# EAGLE design Underwater Camera Rev. A (EAGLE 9.4.0)

## Sheet 1 of 2
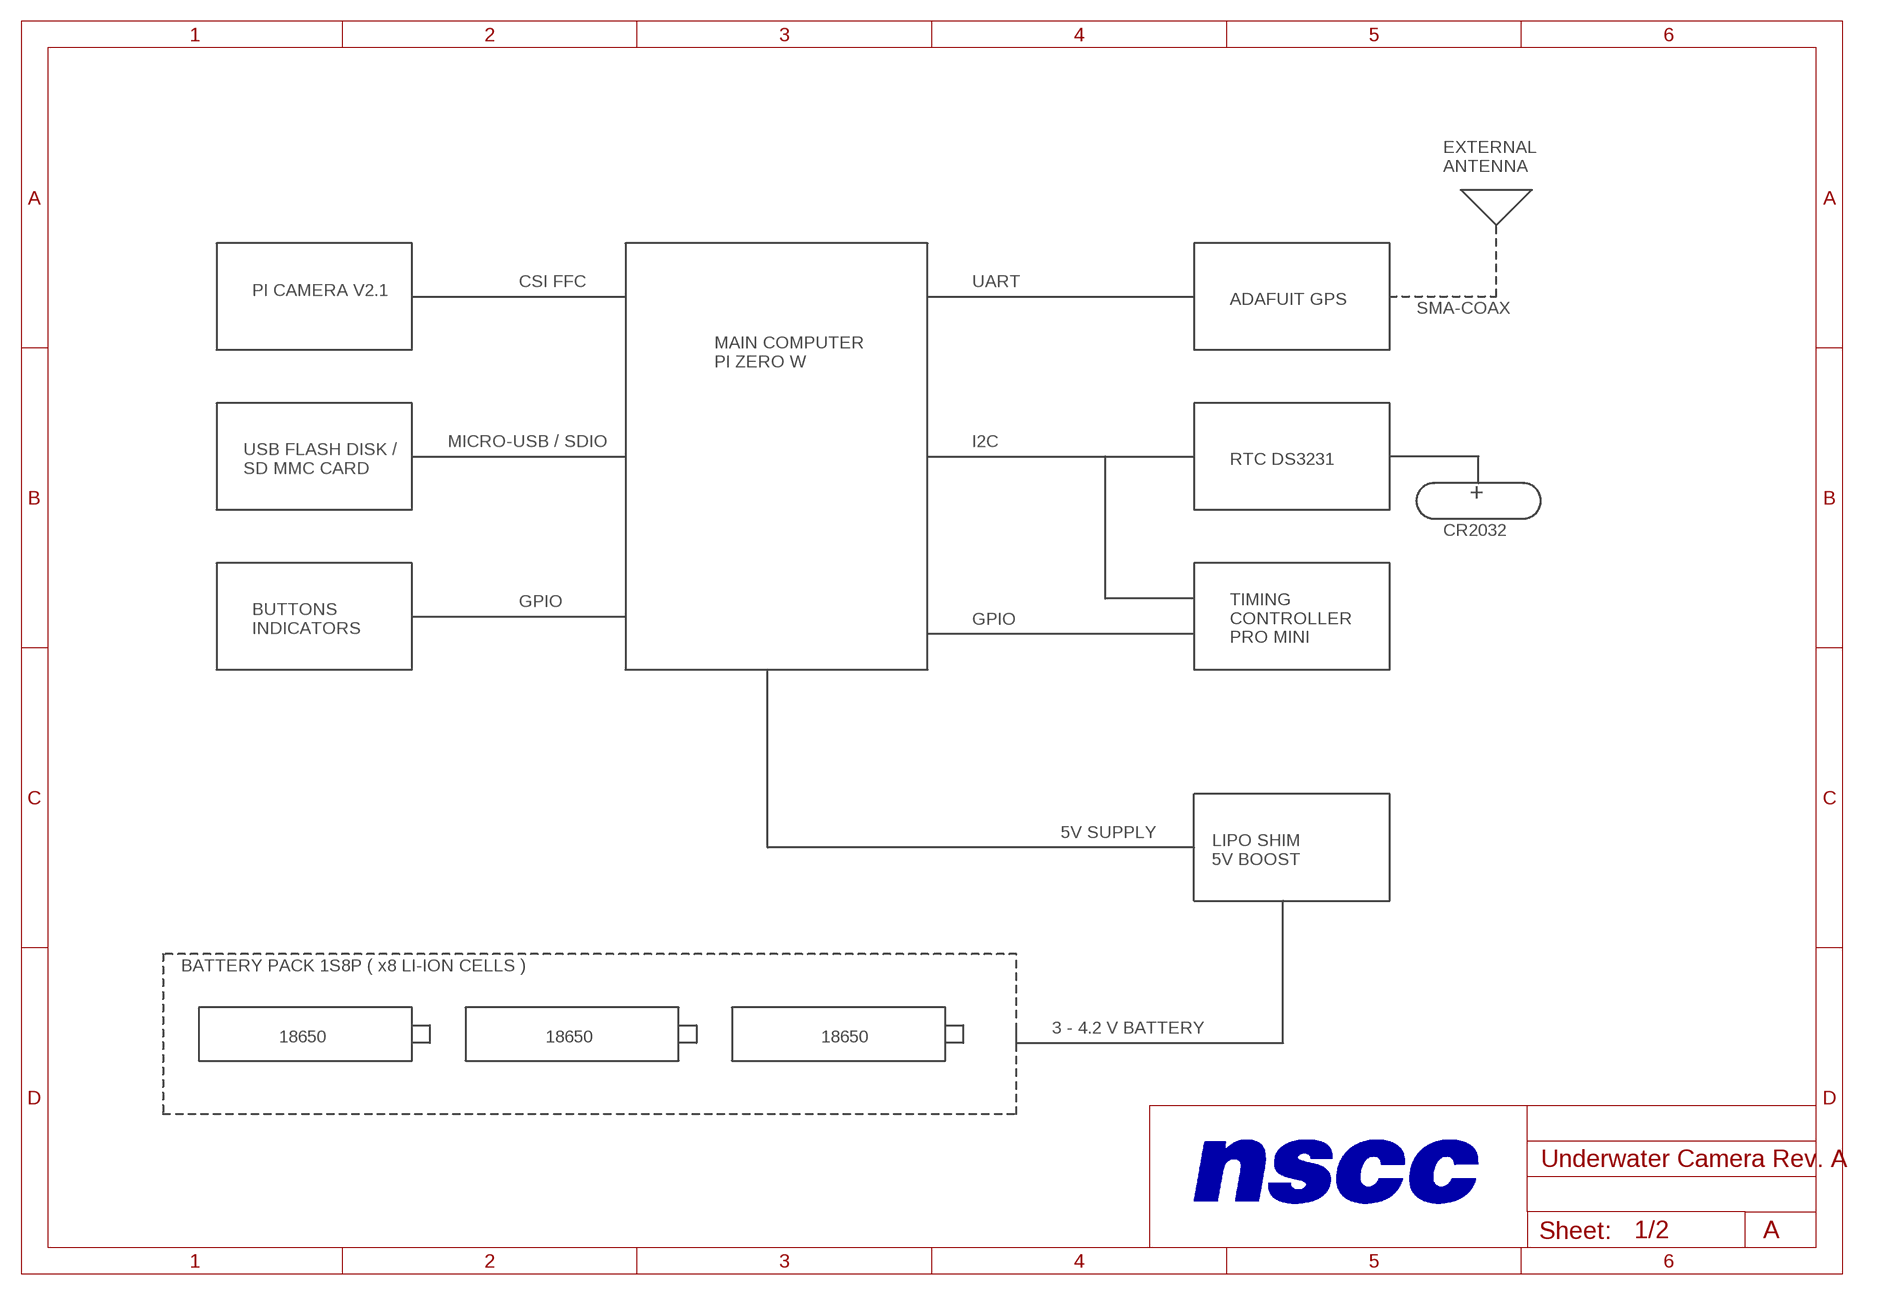
[diagram p0: schematic, sheet 1]

### Notes on the sheet
- EXTERNAL 
  ANTENNA
- CSI FFC | UART
- PI CAMERA V2.1
- ADAFUIT GPS
- SMA-COAX
- MAIN COMPUTER
  PI ZERO W
- MICRO-USB / SDIO | I2C
- RTC DS3231
- USB FLASH DISK /
  SD MMC CARD
- +
- CR2032
- GPIO
- GPIO
- BUTTONS
  INDICATORS
- TIMING 
  CONTROLLER
  PRO MINI
- 5V SUPPLY
- LIPO SHIM
  5V BOOST
- BATTERY PACK 1S8P ( x8 LI-ION CELLS )
- 3 - 4.2 V BATTERY
- 18650 | 18650 | 18650
- A

## Sheet 2 of 2
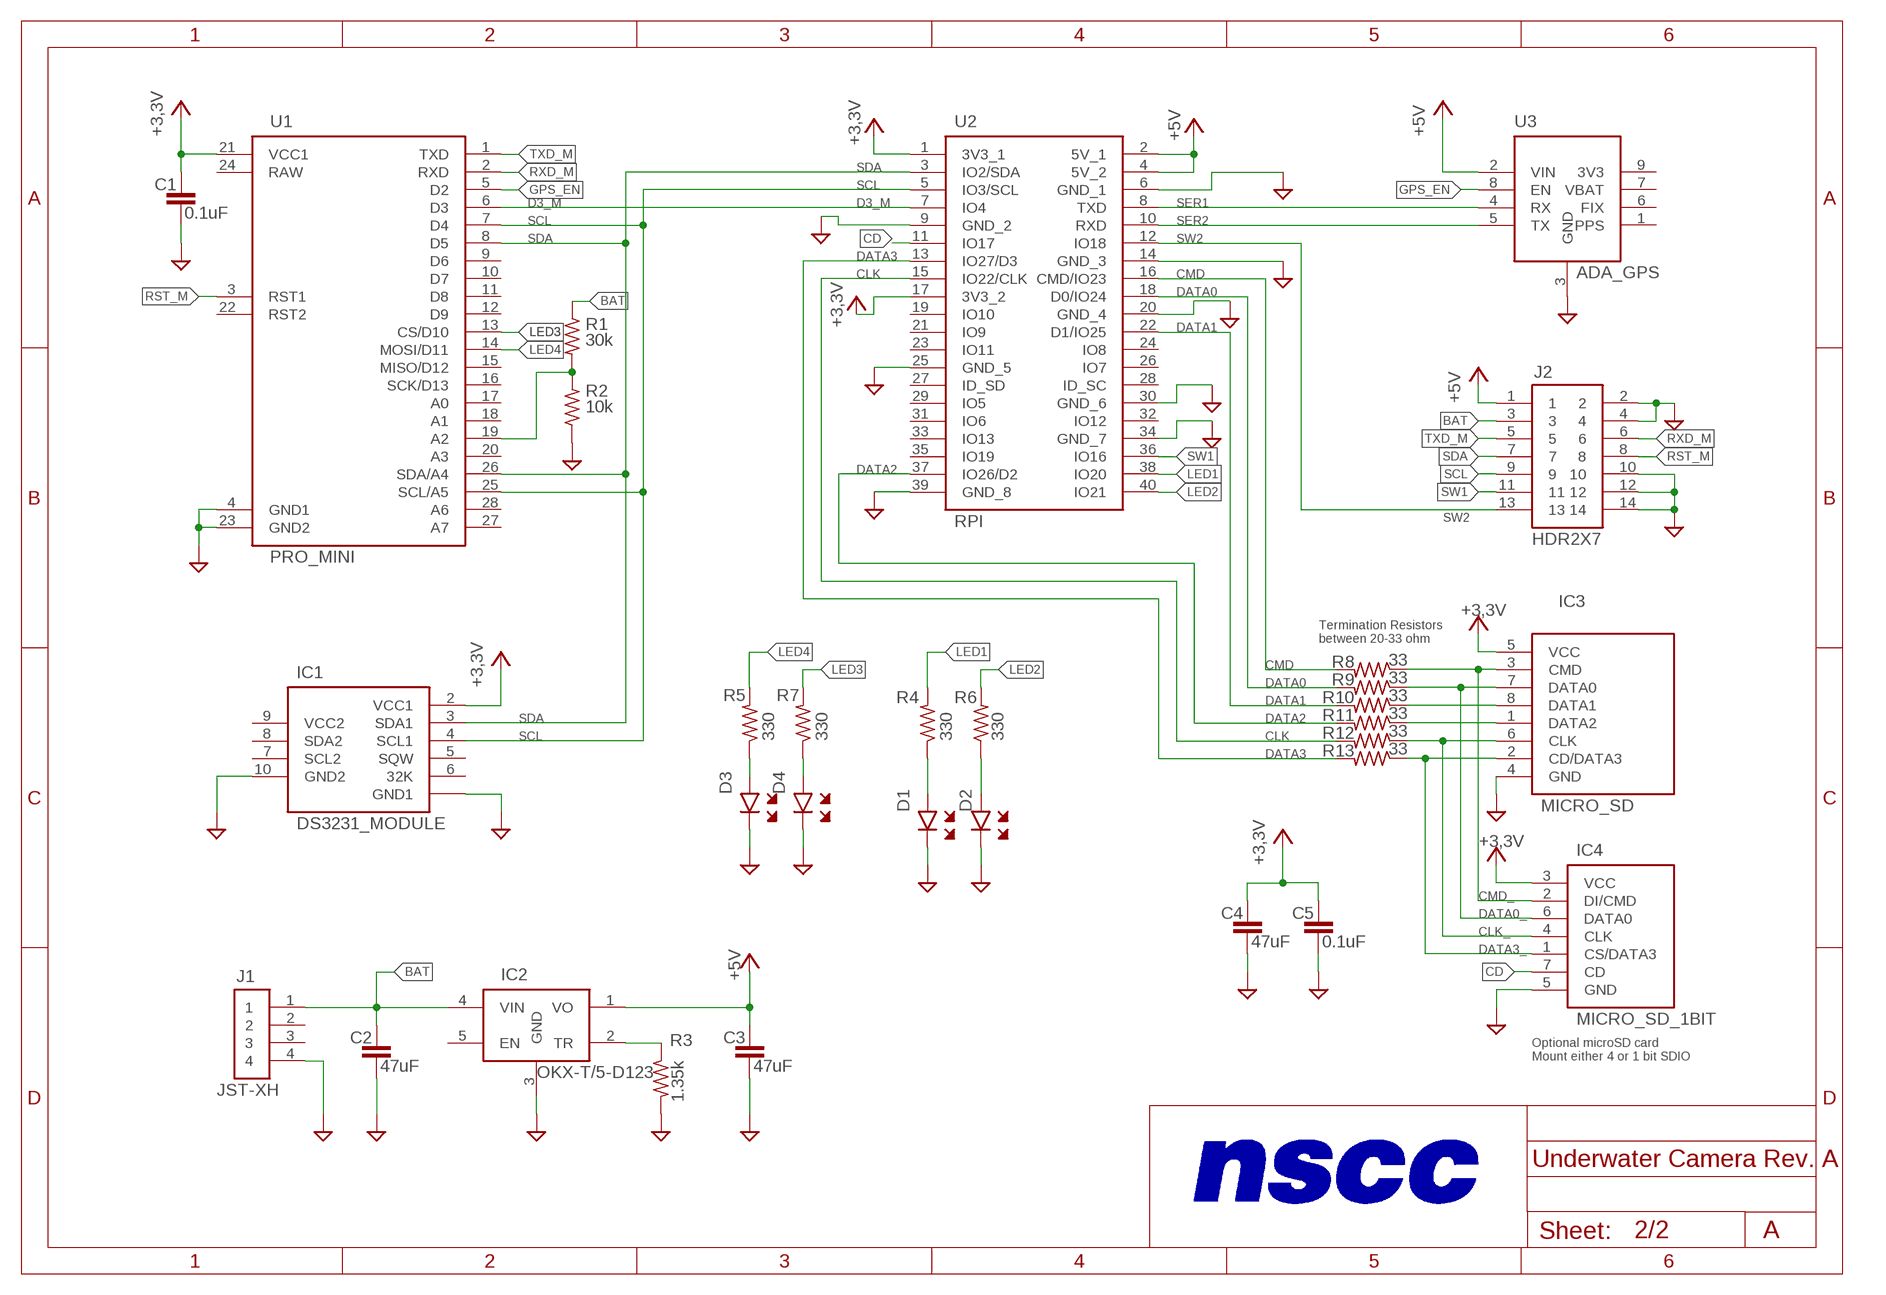
[diagram p1: schematic, sheet 2]

### Parts
C1  0.1uF  CAP_THCAP-TH-2MM  [CAPPRD254W65D300H300B]
C2  47uF  CAP_THCAP-ELECTRO-5.08  [CAPPRD508W65D1000H1100B]
C3  47uF  CAP_THCAP-ELECTRO-5.08  [CAPPRD508W65D1000H1100B]
C4  47uF  CAP_THCAP-ELECTRO-5.08  [CAPPRD508W65D1000H1100B]
C5  0.1uF  CAP_THCAP-TH-2MM  [CAPPRD254W65D300H300B]
D1  LED_THLED-2.54  [LEDRD254W60D565H860B]
D2  LED_THLED-2.54  [LEDRD254W60D565H860B]
D3  LED_THLED-2.54  [LEDRD254W60D565H860B]
D4  LED_THLED-2.54  [LEDRD254W60D565H860B]
IC1  DS3231_MODULE  [DS3231_MODULE]
IC2  OKX-T/5-D123  OKX-T/5-D123DMODEL  [OKX-T/5-D12]
IC3  MICRO_SD  MICRO_SD_SNIFFER  [MICRO_SD_SDIO]
IC4  MICRO_SD_1BIT  MICRO_SD  [MICRO_SD_SDIO1B]
J1  JST-XH  HDR1X4JST-XH  [HDR1X4]
J2  HDR2X7  HDR2X7HDR2X7  [HDR2X7]
R1  30k  RES_THRES-D8.5  [RESAD1176W63L850D250B]
R2  10k  RES_THRES-D8.5  [RESAD1176W63L850D250B]
R3  1.35k  RES_THRES-D8.5  [RESAD1176W63L850D250B]
R4  330  RES_THRES-D8.5  [RESAD1176W63L850D250B]
R5  330  RES_THRES-D8.5  [RESAD1176W63L850D250B]
R6  330  RES_THRES-D8.5  [RESAD1176W63L850D250B]
R7  330  RES_THRES-D8.5  [RESAD1176W63L850D250B]
R8  33  RES_THRES-D8.5  [RESAD1176W63L850D250B]
R9  33  RES_THRES-D8.5  [RESAD1176W63L850D250B]
R10  33  RES_THRES-D8.5  [RESAD1176W63L850D250B]
R11  33  RES_THRES-D8.5  [RESAD1176W63L850D250B]
R12  33  RES_THRES-D8.5  [RESAD1176W63L850D250B]
R13  33  RES_THRES-D8.5  [RESAD1176W63L850D250B]
U1  PRO_MINI  [PRO_MINI]
U2  RPI  [PI_ZERO_W]
U3  ADA_GPS  ADA_ULTIMATE_GPS9P_BREAKOUT  [ADA_ULTIMATE_GPS]

### Nets
+3,3V: C1.1 C4.1 C5.1 IC1.2(VCC1) IC3.5(VCC) IC4.3(VCC) U1.21(VCC1) U2.1(3V3_1) U2.17(3V3_2)
+5V: C3.1 IC2.1(VO) J2.1 U2.2(5V_1) U2.4(5V_2) U3.2(VIN)
BAT: C2.1 IC2.4(VIN) J1.1 J2.3 R1.1
BAT_IN: R1.2 R2.2 U1.19(A2)
CD: IC4.7(CD) U2.11(IO17)
CLK: R12.2 U2.15(IO22/CLK)
CLK_: IC3.6(CLK) IC4.4(CLK) R12.1
CMD: R8.2 U2.16(CMD/IO23)
CMD_: IC3.3(CMD) IC4.2(DI/CMD) R8.1
D3_M: U1.6(D3) U2.7(IO4)
DATA0: R9.2 U2.18(D0/IO24)
DATA0_: IC3.7(DATA0) IC4.6(DATA0) R9.1
DATA1: R10.2 U2.22(D1/IO25)
DATA1_: IC3.8(DATA1) R10.1
DATA2: R11.2 U2.37(IO26/D2)
DATA2_: IC3.1(DATA2) R11.1
DATA3: R13.2 U2.13(IO27/D3)
DATA3_: IC3.2(CD/DATA3) IC4.1(CS/DATA3) R13.1
GND: C1.2 C2.2 C3.2 C4.2 C5.2 D1.2 D2.2 D3.2 D4.2 IC1.1(GND1) IC1.10(GND2) IC2.3(GND) IC3.4(GND) IC4.5(GND) J1.4 J2.2 J2.4 J2.10 J2.12 J2.14 R2.1 R3.2 U1.4(GND1) U1.23(GND2) U2.6(GND_1) U2.9(GND_2) U2.14(GND_3) U2.20(GND_4) U2.25(GND_5) U2.30(GND_6) U2.34(GND_7) U2.39(GND_8) U3.3(GND)
GPS_EN: U1.5(D2) U3.8(EN)
LED1: R4.2 U2.38(IO20)
LED2: R6.2 U2.40(IO21)
LED3: R7.2 U1.13(CS/D10)
LED4: R5.2 U1.14(MOSI/D11)
N$1: D4.1 R7.1
N$2: IC2.2(TR) R3.1
N$10: D1.1 R4.1
N$11: D2.1 R6.1
N$15: D3.1 R5.1
RST_M: J2.8 U1.3(RST1)
RXD_M: J2.6 U1.2(RXD)
SCL: IC1.4(SCL1) J2.9 U1.7(D4) U1.25(SCL/A5) U2.5(IO3/SCL)
SDA: IC1.3(SDA1) J2.7 U1.8(D5) U1.26(SDA/A4) U2.3(IO2/SDA)
SER1: U2.8(TXD) U3.4(RX)
SER2: U2.10(RXD) U3.5(TX)
SW1: J2.11 U2.36(IO16)
SW2: J2.13 U2.12(IO18)
TXD_M: J2.5 U1.1(TXD)
Unconnected: IC1.5(SQW) IC1.6(32K) IC1.7(SCL2) IC1.8(SDA2) IC1.9(VCC2) IC2.5(EN) J1.2 J1.3 U1.9(D6) U1.10(D7) U1.11(D8) U1.12(D9) U1.15(MISO/D12) U1.16(SCK/D13) U1.17(A0) U1.18(A1) U1.20(A3) U1.22(RST2) U1.24(RAW) U1.27(A7) U1.28(A6) U2.19(IO10) U2.21(IO9) U2.23(IO11) U2.24(IO8) U2.26(IO7) U2.27(ID_SD) U2.28(ID_SC) U2.29(IO5) U2.31(IO6) U2.32(IO12) U2.33(IO13) U2.35(IO19) U3.1(PPS) U3.6(FIX) U3.7(VBAT) U3.9(3V3)

### Notes on the sheet
- Termination Resistors
  between 20-33 ohm
- Optional microSD card
  Mount either 4 or 1 bit SDIO
- A

## Library data of the parts
C1-C5 = Underwater-Camera-v2.0:CAP_TH: Capacitor Electro. TH
D1-D4 = Underwater-Camera-v2.0:LED_TH: TH LED - large
IC1 = Underwater-Camera-v2.0:DS3231_MODULE: DS3231 RTC Breakout Module
IC2 = Underwater-Camera-v2.0:OKX-T/5-D12: OKX-T/5-D12 by Murata Inc. - Monolithic DC/DC Converter input: 8.3-13.8v output: <5.5v adjustable current: 5A power: 25W
IC3 = Underwater-Camera-v2.0:MICRO_SD_SNIFFER: SparkFun microSD sniffer - breaks out SDIO interface https://www.sparkfun.com/products/9419
IC4 = Underwater-Camera-v2.0:MICRO_SD: Sparkfun microSD Breakout - SPI/SDIO 1bit accessible https://www.sparkfun.com/products/554
J1 = Underwater-Camera-v2.0:HDR1X4: HEADER 1x4
J2 = Underwater-Camera-v2.0:HDR2X7
R1-R13 = Underwater-Camera-v2.0:RES_TH: Resistor TH
U1 = Underwater-Camera-v2.0:PRO_MINI: Arduino Pro Mini from SparkFun 3.3V
U2 = Underwater-Camera-v2.0:RPI: Pi Header with different package variations
U3 = Underwater-Camera-v2.0:ADA_ULTIMATE_GPS: Ultimate GPS from Adafruit - Breakout https://learn.adafruit.com/adafruit-ultimate-gps

## Board
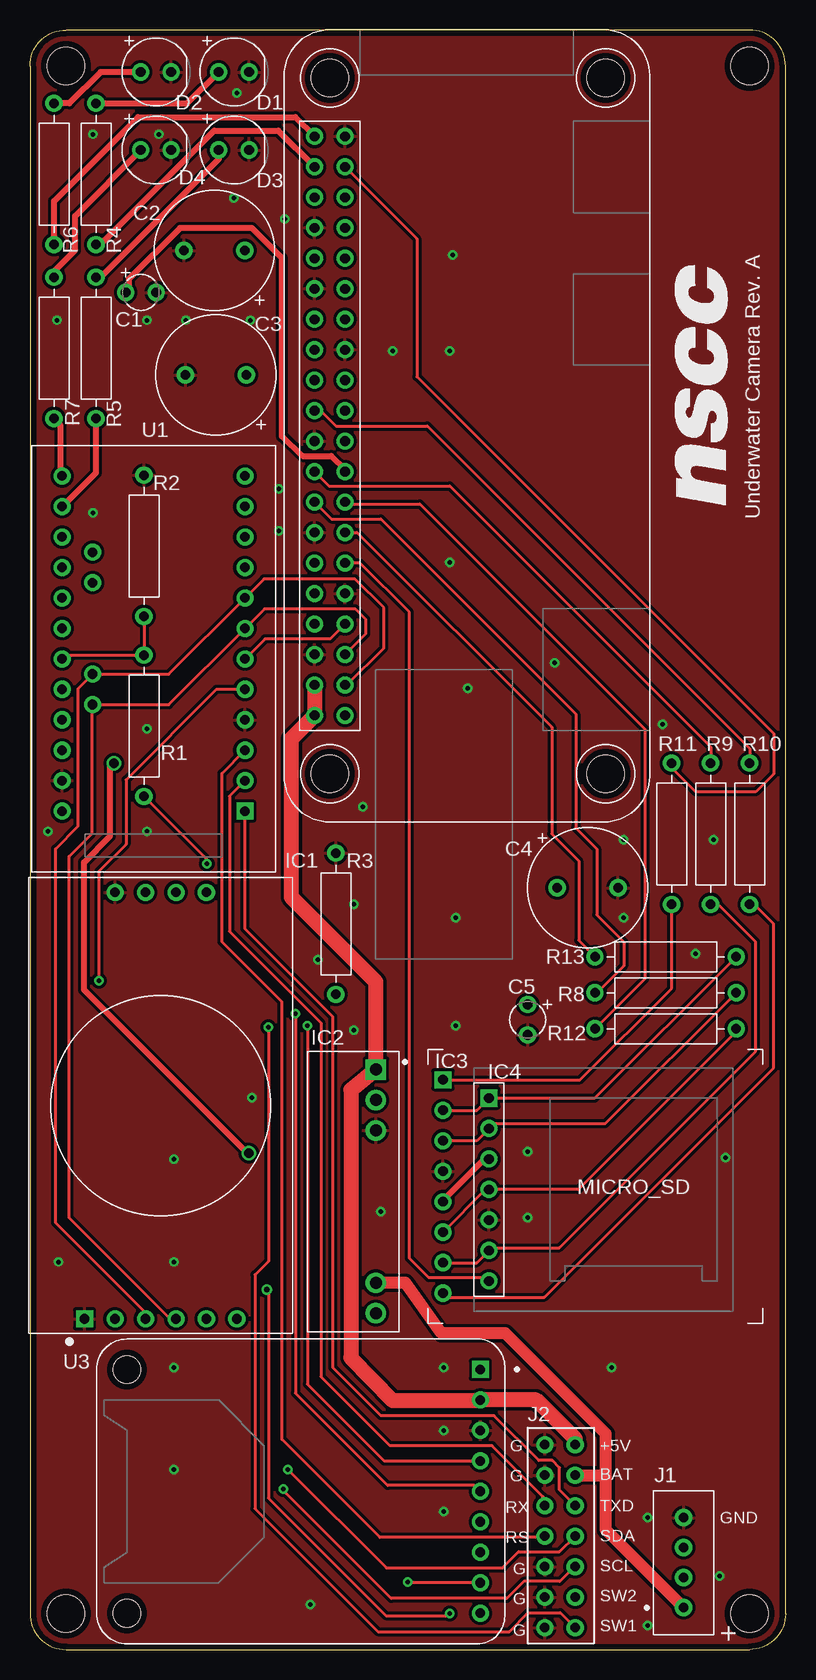
[diagram p2: board, top side]
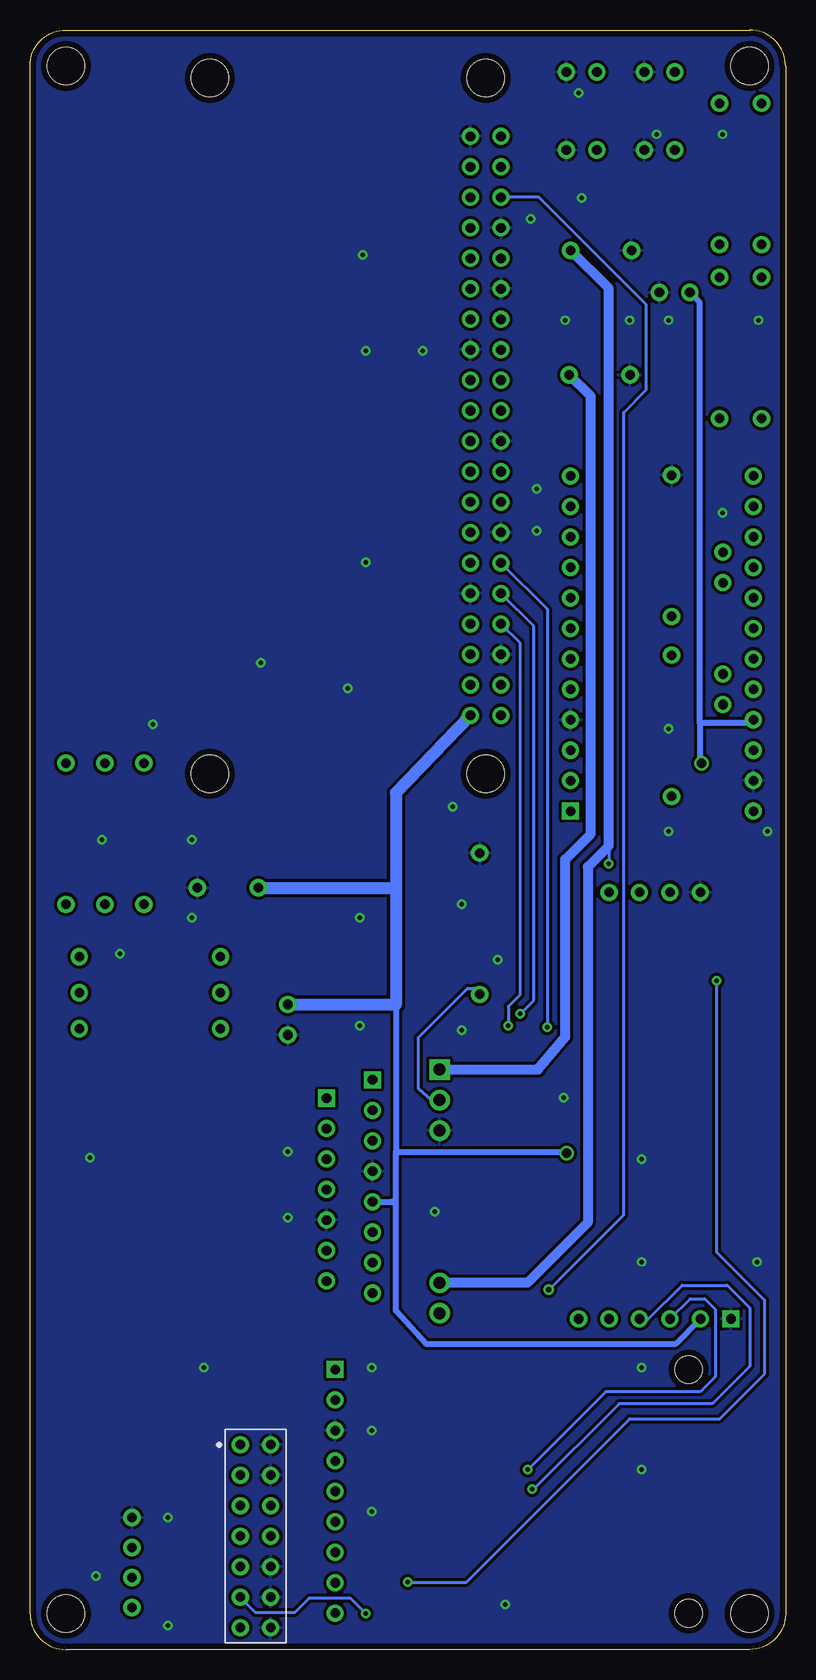
[diagram p3: board, bottom side, seen from below]

Size 63 x 135 mm. Coordinates in mm from the lower left corner, seen from the top.
Outline: 3,0 60,0 arc90 63,3 63,132 arc90 60,135 3,135 arc90 0,132 0,3 arc90 3,0
Copper layers (1*16): Top 0.035mm / dielectric 1.5mm / Bottom 0.035mm
Design rules "default *": minimum track width 10mil, minimum drill 10mil, track to track 10mil, track to pad 10mil, pad to pad 10mil, via to via 10mil, smd to smd 10mil, copper to edge 20mil, drill to drill 10mil, minimum pad ring 10mil, minimum via ring 8mil, stop-mask expansion 4mil, vias tented up to drill 0mil, thermal gap 10mil
Holes 3.1 mm at 60,132 60,3 3,3 3,132

### Footprints (pad centres in the part's own frame; a part is rotated, then mirrored left to right if it is on the bottom)
CAPPRD254W65D300H300B = drill 0.8 pad 1.422: 1 -1.27,0; 2 1.27,0
CAPPRD508W65D1000H1100B = drill 0.8 pad 1.422: 1 -2.54,0; 2 2.54,0
LEDRD254W60D565H860B = drill 0.8 pad 1.422: 1 -1.27,0; 2 1.27,0
DS3231_MODULE = drill 0.8 pad 1.422 square: 1 -6.35,-17.78 | drill 0.8 pad 1.422: 2 -3.81,-17.78; 3 -1.27,-17.78; 4 1.27,-17.78; 5 3.81,-17.78; 6 6.35,-17.78; 7 3.81,17.78; 8 1.27,17.78; 9 -1.27,17.78; 10 -3.81,17.78
OKX-T/5-D12 = drill 1 pad 1.705 square: 1 21.844,1.905 | drill 1 pad 1.705: 2 19.304,1.905; 3 16.764,1.905; 4 4.064,1.905; 5 1.524,1.905
MICRO_SD_SDIO = drill 0.8 pad 1.422 square: 1 -8.89,-12.7 | drill 0.8 pad 1.422: 2 -6.35,-12.7; 3 -3.81,-12.7; 4 -1.27,-12.7; 5 1.27,-12.7; 6 3.81,-12.7; 7 6.35,-12.7; 8 8.89,-12.7
MICRO_SD_SDIO1B = drill 0.8 pad 1.422 square: 1 2.54,1.27 | drill 0.8 pad 1.422: 2 5.08,1.27; 3 7.62,1.27; 4 10.16,1.27; 5 12.7,1.27; 6 15.24,1.27; 7 17.78,1.27
HDR1X4 = drill 0.8 pad 1.422: 1 0,0; 2 2.5,0; 3 5,0; 4 7.5,0
HDR2X7 = drill 0.8 pad 1.422: 1 0,0; 2 0,2.54; 3 2.54,0; 4 2.54,2.54; 5 5.08,0; 6 5.08,2.54; 7 7.62,0; 8 7.62,2.54; 9 10.16,0; 10 10.16,2.54; 11 12.7,0; 12 12.7,2.54; 13 15.24,0; 14 15.24,2.54
RESAD1176W63L850D250B = drill 0.8 pad 1.422: 1 -5.88,0; 2 5.88,0
PRO_MINI = drill 0.8 pad 1.422 square: 1 -7.62,15.24 | drill 0.8 pad 1.422: 2 -7.62,12.7; 3 -7.62,10.16; 4 -7.62,7.62; 5 -7.62,5.08; 6 -7.62,2.54; 7 -7.62,0; 8 -7.62,-2.54; 9 -7.62,-5.08; 10 -7.62,-7.62; 11 -7.62,-10.16; 12 -7.62,-12.7; 13 7.62,-12.7; 14 7.62,-10.16; 15 7.62,-7.62; 16 7.62,-5.08; 17 7.62,-2.54; 18 7.62,0; 19 7.62,2.54; 20 7.62,5.08; 21 7.62,7.62; 22 7.62,10.16; 23 7.62,12.7; 24 7.62,15.24; 25 5.08,6.35; 26 5.08,3.81; 27 5.08,-3.81; 28 5.08,-6.35
PI_ZERO_W = drill 0.8 pad 1.422: 1 -1.27,24.13; 2 1.27,24.13; 3 -1.27,21.59; 4 1.27,21.59; 5 -1.27,19.05; 6 1.27,19.05; 7 -1.27,16.51; 8 1.27,16.51; 9 -1.27,13.97; 10 1.27,13.97; 11 -1.27,11.43; 12 1.27,11.43; 13 -1.27,8.89; 14 1.27,8.89; 15 -1.27,6.35; 16 1.27,6.35; 17 -1.27,3.81; 18 1.27,3.81; 19 -1.27,1.27; 20 1.27,1.27; 21 -1.27,-1.27; 22 1.27,-1.27; 23 -1.27,-3.81; 24 1.27,-3.81; 25 -1.27,-6.35; 26 1.27,-6.35; 27 -1.27,-8.89; 28 1.27,-8.89; 29 -1.27,-11.43; 30 1.27,-11.43; 31 -1.27,-13.97; 32 1.27,-13.97; 33 -1.27,-16.51; 34 1.27,-16.51; 35 -1.27,-19.05; 36 1.27,-19.05; 37 -1.27,-21.59; 38 1.27,-21.59; 39 -1.27,-24.13; 40 1.27,-24.13 | hole 3.1: 0,29; 0,-29; -23,29; -23,-29
ADA_ULTIMATE_GPS = drill 0.8 pad 1.422 square: 1 10.16,-15.494 | drill 0.8 pad 1.422: 2 7.62,-15.494; 3 5.08,-15.494; 4 2.54,-15.494; 5 0,-15.494; 6 -2.54,-15.494; 7 -5.08,-15.494; 8 -7.62,-15.494; 9 -10.16,-15.494 | hole 2.286: -10.16,13.97; 10.16,13.97

### Placement (x,y rotation side)
C1  9.25,113.12 0 top
C2  15.38,116.62 180 top
C3  15.5,106.25 180 top
C4  46.5,63.5 0 top
C5  41.5,52.5 270 top
D1  17,131.5 0 top
D2  10.5,131.5 0 top
D3  17,125 0 top
D4  10.5,125 0 top
IC1  10.9,45.34 0 top
IC2  30.75,26.5 90 top
IC3  47.14,38.6 270 top
IC4  37,48.5 270 top
J1  54.5,3.5 90 top
J2  45.46,17.07 270 bottom
R1  9.5,77 90 top
R2  9.5,92 270 top
R3  25.5,60.5 90 top
R4  5.5,123 270 top
R5  5.5,108.5 270 top
R6  2,123 270 top
R7  2,108.5 270 top
R8  53,54.75 180 top
R9  56.75,68 90 top
R10  60,68 90 top
R11  53.5,68 90 top
R12  53,51.75 180 top
R13  53,57.75 180 top
U1  10.3,85.12 180 top
U2  25,102 180 top
U3  22.06,13.19 90 top

### Tracks (layer width: path | path; a pad name or v marks a point on that pad's centre or on a via)
+3,3V  (via drill 0.8)
  Top 0.508: v18.25,41.38 18.12,41.38 4.5,55 4.5,65.62 6.65,67.78 6.65,73.53 v7,73.88 | IC4.3 37.9,40.88 34.44,37.42 IC3.5 | C1.1 8.24,113.39 8.24,114.24 12.5,118.5 18.5,118.5 21,116 21,101.13 22.73,99.5 25.11,99.5 26.27,98.34 U2.17
  Bottom 0.508: IC1.2 9.15,25.5 30,25.5 32.5,28.24 32.5,37.25 | 7.15,77.25 7.15,112.3 C1.1 | 32.5,41.5 32.5,53.75 32.76,53.77 | 32.5,41.5 18.38,41.5 v18.25,41.38 | 7.15,77.25 7.15,74.03 v7,73.88 | U1.21 2.93,77.25 7.15,77.25 | 32.5,37.25 32.5,41.5 | IC3.5 32.82,37.33 32.5,37.25
  Bottom 1.016: U2.1 32.5,71.4 32.5,63.5 | 32.5,63.5 32.5,53.75 | C5.1 32.76,53.77 | C4.1 32.5,63.5
+5V
  Top 1.27: U2.4 U2.2 21.81,75.95 21.81,62.69 28.84,55.66 IC2.1 26.75,46.66 26.75,24.33 30.26,20.75 37.5,20.75 U3.2 42.23,20.8 45.46,17.57 J2.1
  Bottom 0.813: C3.1 16.25,104.46 16.25,68 18.38,65.88 18.38,51.05 20.64,48.34 IC2.1
BAT  (via drill 0.35)
  Top 0.254: R1.1 14.75,65.87 v14.75,65.5
  Top 1.016: J1.1 48,10 48,14.5 | 48,14.5 48,18 39.62,26.38 34.32,26.38 31.3,30.56 IC2.4 | J2.3 47.97,14.53 48,14.5
  Bottom 0.254: 14.75,67 v14.75,65.5
  Bottom 0.813: IC2.4 21.53,30.56 16.5,35.59 16.5,65.25 14.75,67 14.75,113.46 C2.1
BAT_IN
  Top 0.254: R2.2 R1.2 2.98,82.88 U1.19
CD
  Top 0.254: IC4.7 37.99,31 33.25,31 31.62,32.62 31.62,86.47 27.52,90.57 U2.11
CLK
  Top 0.254: U2.15 26.42,95.5 32.5,95.5 51.25,76.75 51.25,55.88 R12.2
CLK_
  Top 0.254: IC3.6 37.99,38.34 IC4.4 45.72,38.34 58.88,51.51 R12.1
CMD
  Top 0.254: U2.16 25.13,94.25 29.25,94.25 45.5,78 45.5,68.5 47.25,66.75 47.25,61.25 49.5,59 49.5,57 47.25,54.75 R8.2
CMD_
  Top 0.254: IC3.3 37.26,42.41 IC4.2 38.67,43.83 47.95,43.83 R8.1
D3_M
  Top 0.254: U2.7 25.03,84.25 19.59,84.25 U1.6
DATA0
  Top 0.254: U2.18 24.92,97 35,97 56.75,75.25 R9.2
DATA0_
  Top 0.254: IC3.7 37.26,32.25 IC4.6 38.51,33.5 44.13,33.5 60.5,49.87 60.5,59 57.38,62.12 R9.1
DATA1
  Top 0.254: U2.22 24.23,103.27 25.5,102 33.12,102 60,75.12 R10.2
DATA1_
  Top 0.254: IC3.8 34.77,29.38 42.88,29.38 62,48.5 62,60.5 60.38,62.12 R10.1
DATA2
  Top 0.254: U2.37 32.27,117.59 32.27,106.09 62,76.36 62,73 60.5,71.5 55.5,71.5 53.5,73.5 R11.2
DATA2_
  Top 0.254: IC3.1 45.87,47.49 53.5,55.12 R11.1
DATA3
  Top 0.254: U2.13 27.27,93.11 43.5,76.88 43.5,68 45.75,65.75 45.75,59.12 R13.2
DATA3_
  Top 0.254: IC3.2 37.26,44.95 IC4.1 47.09,45.96 R13.1
GND  (via drill 0.35)
  other vias: 51.5,2 34.5,11.5 51.5,11 48.5,23.5 34.5,23.5 34.5,18.25 12,15 23.38,3.75 12,32.3 2.38,32.3 12,40.88 29.25,36.5 41.5,36 41.5,41.5 35.5,52 49.5,67.5 49.5,61 57,67.5 52.75,77.12 35.5,61 55.5,58 24,57.5 18.5,46 9.75,68.2 12,23.5 43.75,82.25 1.5,68.2 9.75,76.75 21.25,119.25 20.75,93.25 20.75,96.75 5.25,94.75 18.38,110.8 5.25,126.3 9.75,110.8 2.25,110.8 10.75,126.3 30.25,108.25 13,110.8 35,108.25 36.5,80.12 35,90.62 57.5,6.12 27,62.12 27,51.62 58,41 35.25,116.25 17,121 17.25,129.75 27.75,70.25
  pour Bottom (isolate 0.254): 0,0 0,135 63,135 63,0
  pour Top (isolate 0.254): 0,0 0,135 63,135 63,0
GPS_EN  (via drill 0.35)
  Top 0.254: U1.5 15.54,80.04 8,72.5 8,67.12 5.75,64.87 v5.75,55.75 | U3.8 31.56,5.57 v31.5,5.62
  Bottom 0.254: v31.5,5.62 26.62,5.62 13,19.25 5.5,19.25 1.75,23 1.75,29.12 5.75,33.12 v5.75,55.75
LED1
  Top 0.508: R4.2 5.86,117.12 15.37,126.62 20.7,126.62 U2.38
LED2
  Top 0.508: R6.2 2,120.75 9,127.75 22.11,127.75 U2.40
LED3
  Top 0.508: U1.13 2.5,98 2.5,102.12 R7.2
LED4
  Top 0.508: U1.14 5.5,98.1 R5.2
N$1
  Top 0.508: R7.1 2,114.88 3.75,116.63 3.75,119.5 9.23,124.98 D4.1
N$2
  Bottom 0.254: IC2.2 29.54,45.8 30.61,46.73 30.61,51.01 26.51,55.11 25.99,55.11 R3.1
N$10
  Top 0.508: R4.1 13.11,128.88 D1.1
N$11
  Top 0.508: R6.1 3.27,128.88 5.89,131.5 D2.1
N$15
  Top 0.508: R5.1 5.88,114.38 15.73,124.23 D3.1
RST_M
  Top 0.254: J2.8 42.8,9.35 29.18,9.35 21,17.51 21,54 16,59 16,73.04 U1.3
RXD_M
  Top 0.254: J2.6 42.79,12.12 42.79,12.74 38.52,17 30,17 24.25,22.75 24.25,52.25 16.63,59.87 16.63,71.13 U1.2
SCL  (via drill 0.35)
  Top 0.254: IC1.4 11.67,27.56 3.25,35.98 3.25,66.12 5.12,68 5.12,78.67 U1.25 11.57,78.77 U1.7 19.55,86.75 27.12,86.75 28,85.88 28,84.68 U2.5 | J2.9 45.41,6.91 44.18,5.68 41.18,5.68 39.76,4.26 30.12,4.26 21.12,13.25 v21.12,13.38
  Bottom 0.254: IC1.4 11.44,27.56 8.62,30.38 4.88,30.38 3,28.5 3,23.62 6.12,20.5 13.88,20.5 21.06,13.31 v21.12,13.38
SDA  (via drill 0.35)
  Top 0.254: IC1.3 9.63,28.06 2.12,35.56 2.12,66.75 4,68.63 4,80.09 U1.26 11.57,81.31 U1.8 19.51,89.25 27.09,89.25 29.5,86.84 29.5,83.5 26.41,80.41 U2.3 | v21.5,15 21.62,14.88 21.62,14.84 29.72,6.8 39.41,6.8 40.74,8.15 44.13,8.15 J2.7
  Bottom 0.254: IC1.3 7.94,29.25 6.75,29.25 5.88,28.38 5.88,22.75 7.12,21.5 15,21.5 v21.5,15
SER1  (via drill 0.35)
  Top 0.254: v23.12,52 23.12,22.12 29.52,15.72 U3.4
  Bottom 0.254: v23.12,52 23.12,53.62 22.12,54.62 22.12,83.89 U2.8
SER2  (via drill 0.35)
  Top 0.254: v22.12,53 22.12,21.38 29.82,13.69 37.05,13.69 U3.5
  Bottom 0.254: v22.12,53 21,54.12 21,85.3 U2.10
SW1  (via drill 0.35, 0.45)
  Top 0.254: v19.75,30 19.88,29.88 19.88,12.62 29.67,2.83 34.83,2.83 v35,3
  Bottom 0.254: v35,3 36.26,4.26 39.74,4.26 40.94,3.06 44.19,3.06 45.46,4.33 J2.11 | v19.75,30 13.5,36.25 13.5,103.12 11.61,105.01 11.61,112.11 20.55,121.05 U2.36
SW2  (via drill 0.35)
  Top 0.254: J2.13 44.23,3.06 41.53,3.06 39.97,1.5 29,1.5 18.75,11.75 18.75,31.25 19.88,32.38 v19.88,51.88
  Bottom 0.254: U2.12 19.88,86.72 v19.88,51.88
TXD_M
  Top 0.254: J2.5 44.15,13.3 44.15,15.17 43.56,15.76 42.42,15.76 38.69,19.5 29.25,19.5 25.25,23.5 25.25,52.75 17.92,60.08 U1.1

### Text on the board
tPlace: Underwater Camera Rev. A | G | +5V | G | BAT | TXD | RX | GND | RS | SDA | G | SCL | G | SW2 | SW1 | G | +